# EAGLE schematic schematEle (EAGLE 7.5.0)
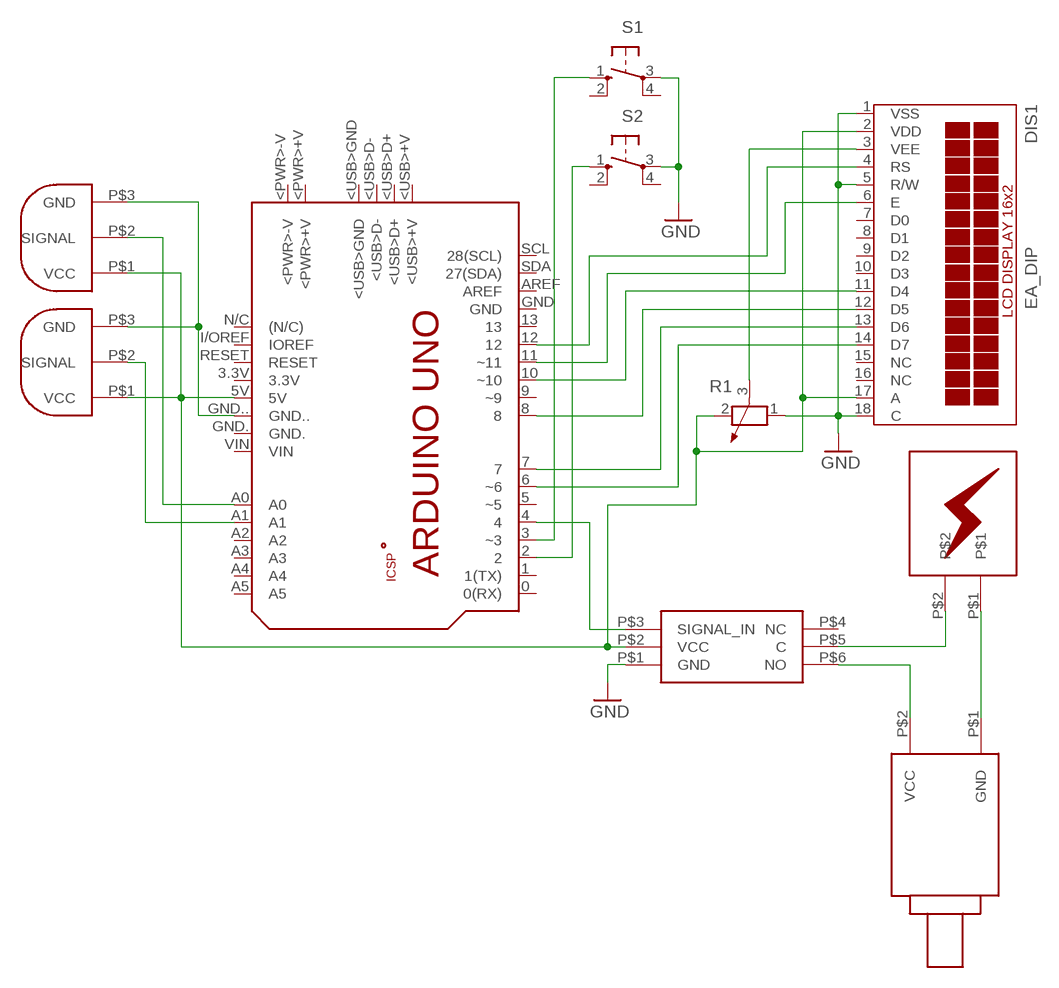
[diagram p0: schematic, sheet 1]

## Parts
DIS1  EA_DIP  [EA_DIP]
PCB1  ARDUINO_UNO  [ARDUINO_UNO]
R1  POTENTIOMETER_PT-10  [PT-10]
RELAY  RELAY  [RELAY]
S1  10-XX  [B3F-10XX]
S2  10-XX  [B3F-10XX]
U$1  POWSOURCE  [SOURCE]
U$2  LM35  [LM35]
U$3  LM35  [LM35]
U$4  MOTOR  [MOTOR]

## Nets
GND: DIS1.1(VSS) DIS1.5(R/W) DIS1.18(C) R1.1 RELAY.P$1(GND) S1.3(P) S2.3(P)
N$1: DIS1.2(VDD) DIS1.17(A) PCB1.5V R1.2 RELAY.P$2(VCC) U$2.P$1(VCC) U$3.P$1(VCC)
N$2: PCB1.A1 U$3.P$2(SIGNAL)
N$3: PCB1.A0 U$2.P$2(SIGNAL)
N$4: PCB1.GND.. U$2.P$3(GND) U$3.P$3(GND)
N$5: DIS1.3(VEE) R1.3
N$6: PCB1.3(~3) S1.1(S)
N$7: PCB1.2 S2.1(S)
N$8: PCB1.4 RELAY.P$3(SIGNAL_IN)
N$9: DIS1.4(RS) PCB1.12
N$10: DIS1.6(E) PCB1.11(~11)
N$11: DIS1.11(D4) PCB1.10(~10)
N$12: DIS1.12(D5) PCB1.8
N$13: DIS1.13(D6) PCB1.7
N$14: DIS1.14(D7) PCB1.6(~6)
N$15: U$1.P$1 U$4.P$1(GND)
N$16: RELAY.P$5(C) U$1.P$2
N$17: RELAY.P$6(NO) U$4.P$2(VCC)
Unconnected: DIS1.7(D0) DIS1.8(D1) DIS1.9(D2) DIS1.10(D3) DIS1.15(NC) DIS1.16(NC) PCB1.0(0(RX)) PCB1.1(1(TX)) PCB1.3.3V PCB1.5(~5) PCB1.9(~9) PCB1.13 PCB1.+5V PCB1.<PWR>+V PCB1.<PWR>-V PCB1.<USB>+V PCB1.<USB>D+ PCB1.<USB>D- PCB1.<USB>GND PCB1.A2 PCB1.A3 PCB1.A4 PCB1.A5 PCB1.AREF PCB1.GND PCB1.GND. PCB1.GND_ PCB1.I/OREF(IOREF) PCB1.MISO PCB1.MOSI PCB1.N/C((N/C)) PCB1.RESET PCB1.RESET. PCB1.SCK PCB1.SCL(28(SCL)) PCB1.SDA(27(SDA)) PCB1.VIN RELAY.P$4(NC) S1.2(S1) S1.4(P1) S2.2(S1) S2.4(P1)

## Library data of the parts
DIS1 = display-lcd:EA_DIP: LCD-MODUL 2x16 - 6,68mm, INKL. KONTROLLER HD44780 Source: Data sheet <http://www.lcd-module.de/pdf/doma/dip162-d.pdf>
PCB1 = E14_Arduino_revB:ARDUINO_UNO: Device for representing an Arduino Uno board with a footprint in an EAGLE design. Created by Dave Young for Element14. More EAGLE documentation at: http://www.element14.com/community/community/knode/cadsoft_eagle
R1 = rcl:POTENTIOMETER_: Potentiometer
RELAY = relayINZ:RELAY
S1 S2 = switch-omron:10-XX: OMRON SWITCH; MPN: B3F-1000; OC_FARNELL: 176432; OC_NEWARK: 36M3542
U$1 = powerSource:POWSOURCE
U$2 U$3 = lm35:LM35
U$4 = pump:MOTOR